# Altium schematic sheet 09_CONSOLE.SchDoc
size 420 x 297 mm; SheetNumber: 3; SheetTotal: 20
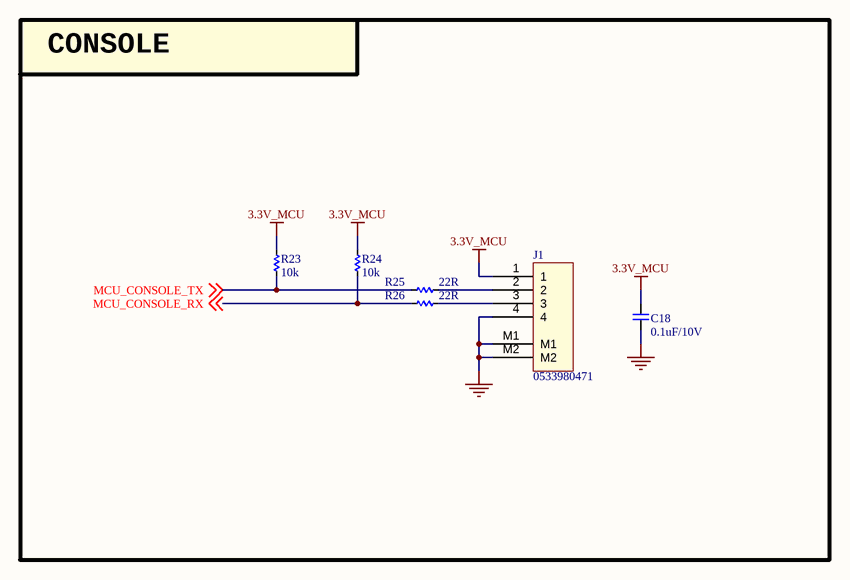
[diagram p0: 09_CONSOLE.SchDoc]

## Parts
C18  0.1uF/10V  [CAP_C_1005X50_L]
J1  0533980471  [MOLEX_0533980471]
R23  10k  [RES_C_1005X40]
R24  10k  [RES_C_1005X40]
R25  22R  [RES_C_1005X40]
R26  22R  [RES_C_1005X40]

## Blocks framed on the sheet
CONSOLE: C18 J1 R23-R26

## Nets
3.3V_MCU: C18.2 J1.1 R23.2 R24.2
GND: C18.1 J1.4 J1.M1 J1.M2
MCU_CONSOLE_RX: R24.1 R26.2 ; off-sheet MCU_CONSOLE_RX
MCU_CONSOLE_TX: R23.1 R25.2 ; off-sheet MCU_CONSOLE_TX
NetJ1_2: J1.2 R25.1
NetJ1_3: J1.3 R26.1

## Notes on the sheet
- Project:
- Sub-system:
- Design by:
- Sheet title:
- Sheet
- of
- Checked by:
- Approved by:
- Revision:
- Document No:
- Size:
- Date:
- A3

## Library data of the parts
C18 = _CAP_C_2: CAP
J1 = Header 4x1_2M
R23-R26 = _RES_B_2: RES